# Altium schematic sheet Esquema.SchDoc
size A4
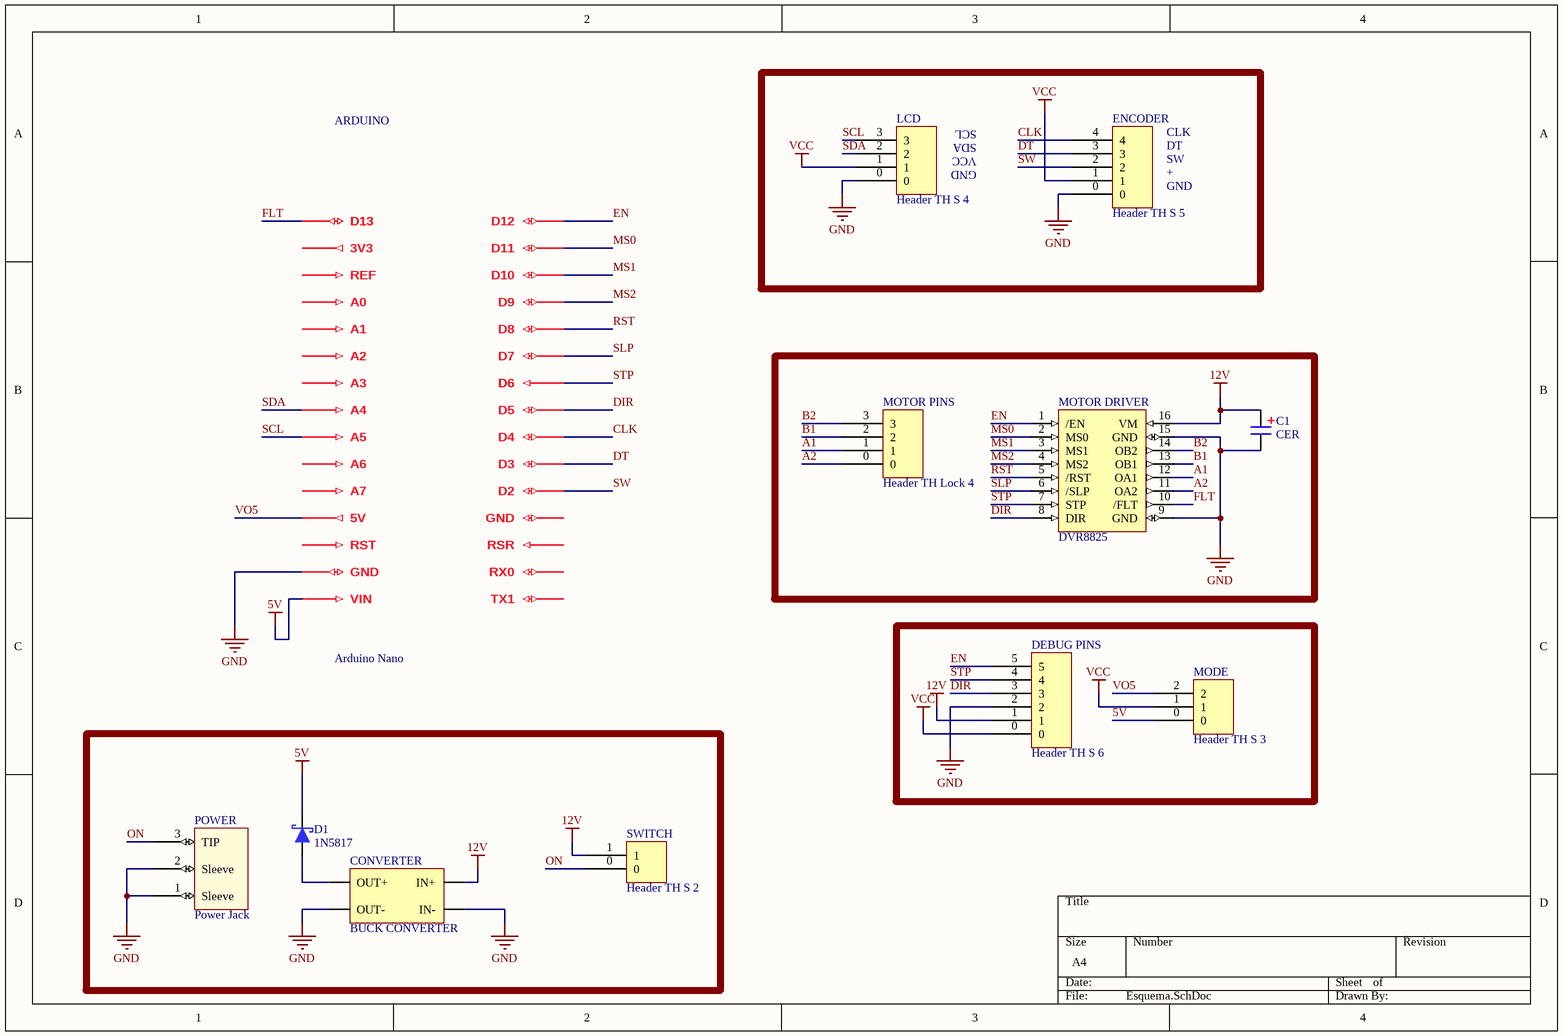
[diagram p0: Esquema.SchDoc]

## Parts
ARDUINO  Arduino Nano  [arduinoNanoPCB]
C1  CER  [Cap ER 8.5D11.5H]
CONVERTER  BUCK CONVERTER  [MP2307N HEADER]
D1  1N5817  [D0 41]
DEBUG_PINS  Header TH S 6  [Header_TH_S_6]
ENCODER  Header TH S 5  [Header_TH_S_5]
LCD  Header TH S 4  [Header_TH_S_4]
MODE  Header TH S 3  [Header_TH_S_3]
MOTOR_DRIVER  DVR8825  [DRV8825]
MOTOR_PINS  Header TH Lock 4  [HEADER_TH_LOCK_4]
POWER  Power Jack  [PoweJack]
SWITCH  Header TH S 2  [Header_TH_S_2]

## Nets
5V: ARDUINO.VIN D1.K MODE.0
12V: C1.+ CONVERTER.IN+ DEBUG_PINS.1 MOTOR_DRIVER.16(VM) SWITCH.1
GND: ARDUINO.G1(GND) C1.- CONVERTER.IN- CONVERTER.OUT- DEBUG_PINS.2 ENCODER.0 LCD.0 MOTOR_DRIVER.9(GND) MOTOR_DRIVER.15(GND) POWER.1(Sleeve) POWER.2(Sleeve)
VCC: DEBUG_PINS.0 ENCODER.1 LCD.1 MODE.1
A1: MOTOR_DRIVER.12(OA1) MOTOR_PINS.1
A2: MOTOR_DRIVER.11(OA2) MOTOR_PINS.0
B1: MOTOR_DRIVER.13(OB1) MOTOR_PINS.2
B2: MOTOR_DRIVER.14(OB2) MOTOR_PINS.3
CLK: ARDUINO.2(D4) ENCODER.4
DIR: ARDUINO.9(D5) DEBUG_PINS.3 MOTOR_DRIVER.8(DIR)
DT: ARDUINO.1(D3) ENCODER.3
EN: ARDUINO.16(D12) DEBUG_PINS.5 MOTOR_DRIVER.1(/EN)
FLT: ARDUINO.17(D13) MOTOR_DRIVER.10(/FLT)
MS0: ARDUINO.15(D11) MOTOR_DRIVER.2(MS0)
MS1: ARDUINO.14(D10) MOTOR_DRIVER.3(MS1)
MS2: ARDUINO.13(D9) MOTOR_DRIVER.4(MS2)
ON: POWER.3(TIP) SWITCH.0
RST: ARDUINO.12(D8) MOTOR_DRIVER.5(/RST)
SCL: ARDUINO.28(A5) LCD.3
SDA: ARDUINO.27(A4) LCD.2
SLP: ARDUINO.11(D7) MOTOR_DRIVER.6(/SLP)
STP: ARDUINO.10(D6) DEBUG_PINS.4 MOTOR_DRIVER.7(STP)
SW: ARDUINO.32(D2) ENCODER.2
VO5: ARDUINO.5V MODE.2
NetCONVERTER_OUT+: CONVERTER.OUT+ D1.A

Not connected (* = marked no-connect by the designer): ARDUINO 3V3 19(A6) 21(REF) 22(A7) 23(A0) 24(A1) 25(A2) 26(A3) 29(RSR) 29A(RST) 30(RX0) 31(TX1) G0(GND)

## Notes on the sheet
- GND
- VCC
- SDA
- SCL
- CLK
- DT
- SW
- +

## Library data of the parts
ARDUINO = Arduino Nano: Arduino Nano Generico; Fecha Creacion: 01/04/2017
C1 = Cap R8D12H: 470uF 16V; Fecha Creacion: 10/09/2017
CONVERTER = MP2307N BOARD HEADERED: DC-DC BUCK CONVERTER
D1 = Diodo Schottky TH: Diodo Schottky; Fecha: 07/07/2019
DEBUG_PINS = Header TH S 6: Header Through Hole Simple 6 pines; Fecha Creacion: 01/04/2017
ENCODER = Header TH S 5: Header Through Hole Simple 5 pines; Fecha Creacion: 01/04/2017
LCD = Header TH S 4: Header Through Hole Simple 4 pines; Fecha Creacion: 01/04/2017
MODE = Header TH S 3: Header Through Hole Simple 3 pines; Fecha Creacion: 01/04/2017
MOTOR_DRIVER = DVR8825 MODULO: Fecha Creacion: 09/09/2017
MOTOR_PINS = Header TH Lock 4: Header Through Hole Lock 4 pines; Fecha Creacion: 01/04/2017
POWER = PowerJack12V: Power Jack 15mm; Fecha creacion: 25/03/2017
SWITCH = Header TH S 2: Header Through Hole Simple 2 pines; Fecha Creacion: 01/04/2017